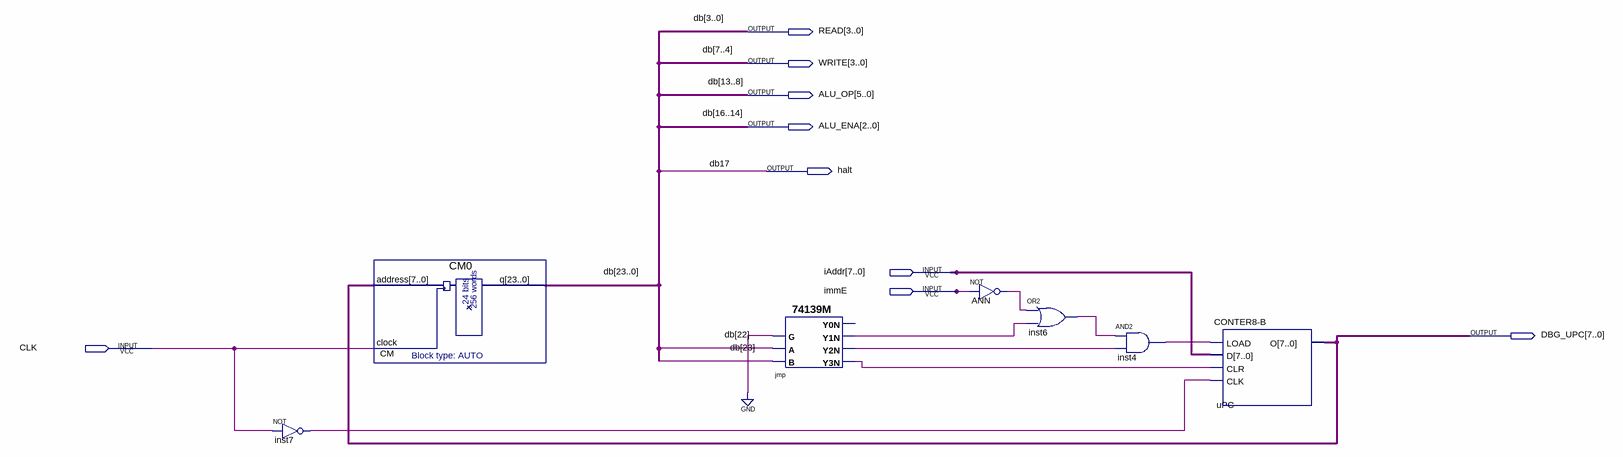
[diagram p0: schematic sheet]
// Quartus schematic CU.bdf as structural Verilog: 7 symbols, 9 pins
module CU (
  input  [7:0] iAddr,
  input  immE,
  input  CLK,
  output [3:0] READ,
  output [3:0] WRITE,
  output [5:0] ALU_OP,
  output [2:0] ALU_ENA,
  output halt,
  output [7:0] DBG_UPC
);

  wire ANN_out, inst4_out, inst6_out, inst7_out, jmp_y1n, jmp_y2n, jmp_y3n;
  wire [23:18] db;

  not inst7 (inst7_out, CLK);
  CM0 CM (.address(DBG_UPC), .clock(CLK), .q({db, halt, ALU_ENA, ALU_OP, WRITE, READ}));
  \74139M  jmp (.B(db[23]), .A(db[22]), .G(1'b0), .Y3N(jmp_y3n), .Y2N(jmp_y2n), .Y1N(jmp_y1n));  // open: Y0N
  not ANN (ANN_out, immE);
  or inst6 (inst6_out, ANN_out, jmp_y1n);
  and inst4 (inst4_out, inst6_out, jmp_y2n);
  \CONTER8-B  uPC (.LOAD(inst4_out), .D(iAddr), .CLR(jmp_y3n), .CLK(inst7_out), .O(DBG_UPC));

  // Other names for the same wires on the sheet: db[17:0] = {halt, ALU_ENA, ALU_OP, WRITE, READ}; db17 = halt
endmodule
